# Altium schematic sheet Stamp-S3Bat_SMD.SchDoc
size A4
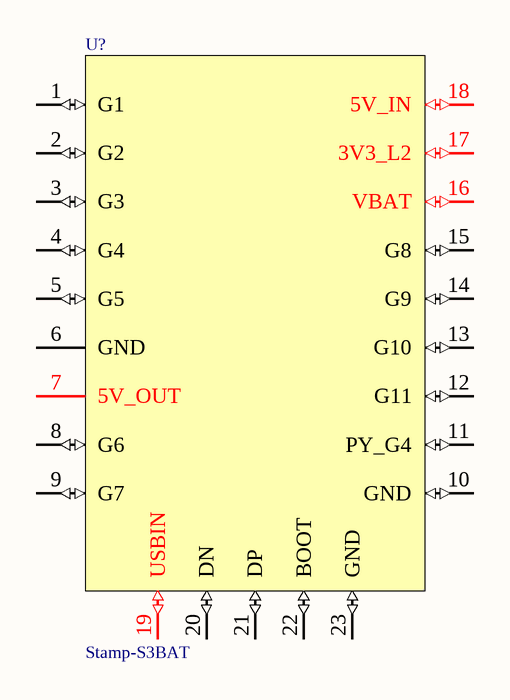
[diagram p0: Stamp-S3Bat_SMD.SchDoc]

## Parts
U?  Stamp-S3BAT  [Stamp-S3BAT]

## Nets

Not connected (* = marked no-connect by the designer): U? 1(G1) 2(G2) 3(G3) 4(G4) 5(G5) 6(GND) 7(5V_OUT) 8(G6) 9(G7) 10(GND) 11(PY_G4) 12(G11) 13(G10) 14(G9) 15(G8) 16(VBAT) 17(3V3_L2) 18(5V_IN) 19(USBIN) 20(DN) 21(DP) 22(BOOT) 23(GND)